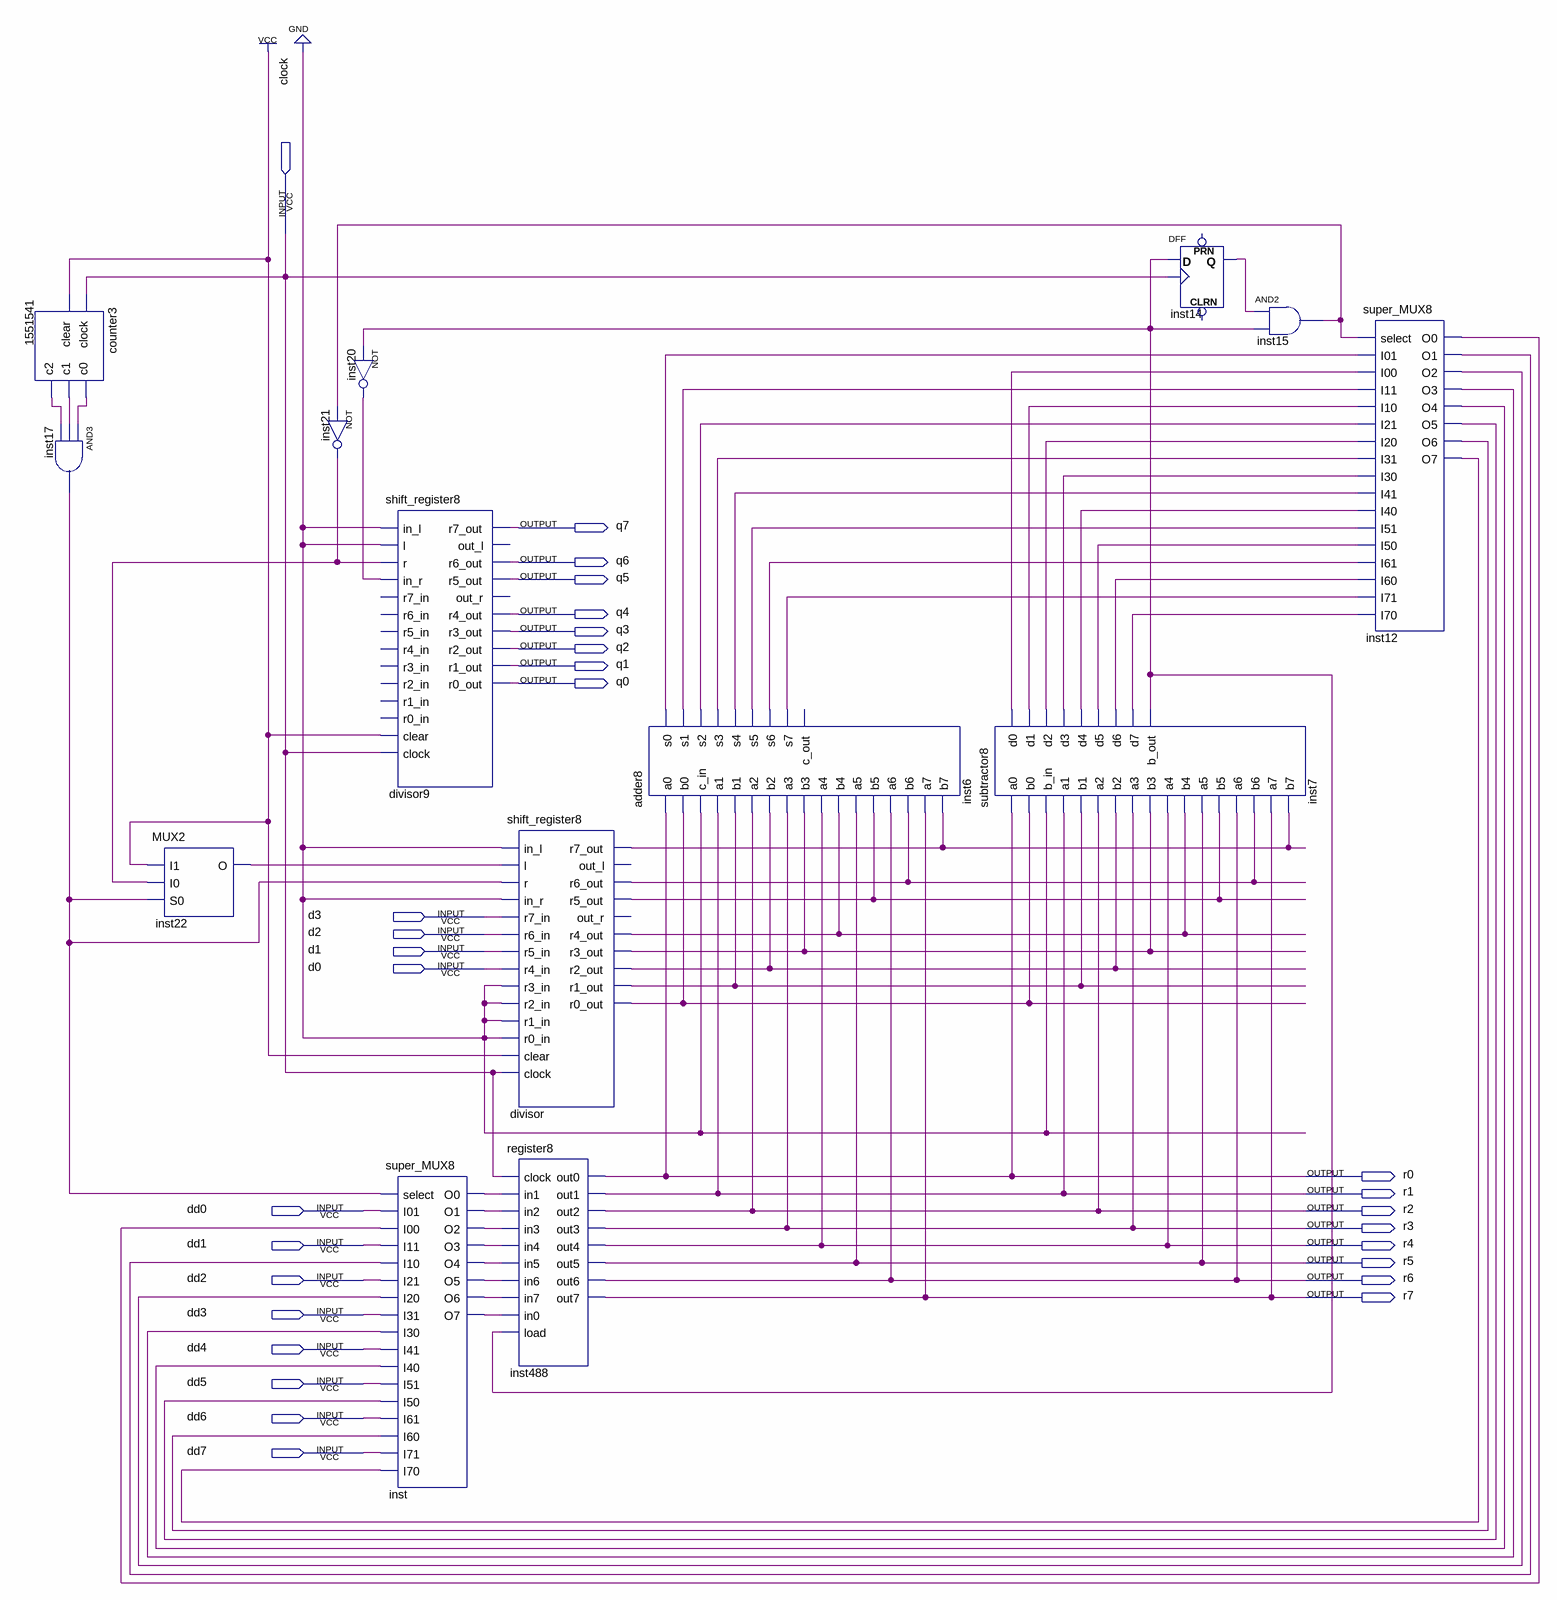
[diagram p0: schematic sheet]
// Quartus schematic Second.bdf as structural Verilog: 14 symbols, 29 pins
module Second (
  input  clock,
  input  d3,
  input  d2,
  input  d1,
  input  d0,
  input  dd0,
  input  dd1,
  input  dd2,
  input  dd3,
  input  dd4,
  input  dd5,
  input  dd6,
  input  dd7,
  output q7,
  output q6,
  output q5,
  output q4,
  output q3,
  output q2,
  output q1,
  output q0,
  output r0,
  output r1,
  output r2,
  output r3,
  output r4,
  output r5,
  output r6,
  output r7
);

  wire divisor_r0_out, divisor_r1_out, divisor_r2_out, divisor_r3_out, divisor_r4_out, divisor_r5_out,
       divisor_r6_out, divisor_r7_out, inst6_s0, inst6_s1, inst6_s2, inst6_s3, inst6_s4, inst6_s5, inst6_s6,
       inst6_s7, inst7_b_out, inst7_d0, inst7_d1, inst7_d2, inst7_d3, inst7_d4, inst7_d5, inst7_d6, inst7_d7,
       inst12_o0, inst12_o1, inst12_o2, inst12_o3, inst12_o4, inst12_o5, inst12_o6, inst12_o7, inst14_q,
       inst15_out, inst17_out, inst20_out, inst21_out, inst22_o, inst_o0, inst_o1, inst_o2, inst_o3, inst_o4,
       inst_o5, inst_o6, inst_o7, n1551541_c0, n1551541_c1, n1551541_c2;

  counter3 u_1551541 (.clock(clock), .clear(1'b1), .c0(n1551541_c0), .c1(n1551541_c1), .c2(n1551541_c2));
  and inst17 (inst17_out, n1551541_c0, n1551541_c1, n1551541_c2);
  MUX2 inst22 (.I1(1'b1), .I0(inst21_out), .S0(inst17_out), .O(inst22_o));
  not inst20 (inst20_out, inst7_b_out);
  not inst21 (inst21_out, inst15_out);
  shift_register8 divisor9 (
    .in_l(1'b0), .l(1'b0), .r(inst21_out), .in_r(inst20_out), .clear(1'b1), .clock(clock), .r7_out(q7),
    .r6_out(q6), .r5_out(q5), .r4_out(q4), .r3_out(q3), .r2_out(q2), .r1_out(q1), .r0_out(q0));  // open: r7_in, r6_in, r5_in, r4_in, r3_in, r2_in, r1_in, r0_in, out_l, out_r
  super_MUX8 inst (
    .select(inst17_out), .I01(dd0), .I00(inst12_o0), .I11(dd1), .I10(inst12_o1), .I21(dd2), .I20(inst12_o2),
    .I31(dd3), .I30(inst12_o3), .I41(dd4), .I40(inst12_o4), .I51(dd5), .I50(inst12_o5), .I61(dd6),
    .I60(inst12_o6), .I71(dd7), .I70(inst12_o7), .O0(inst_o0), .O1(inst_o1), .O2(inst_o2), .O3(inst_o3),
    .O4(inst_o4), .O5(inst_o5), .O6(inst_o6), .O7(inst_o7));
  shift_register8 divisor (
    .in_l(1'b0), .l(inst22_o), .r(inst17_out), .in_r(1'b0), .r7_in(d3), .r6_in(d2), .r5_in(d1), .r4_in(d0),
    .r3_in(1'b0), .r2_in(1'b0), .r1_in(1'b0), .r0_in(1'b0), .clear(1'b1), .clock(clock),
    .r7_out(divisor_r7_out), .r6_out(divisor_r6_out), .r5_out(divisor_r5_out), .r4_out(divisor_r4_out),
    .r3_out(divisor_r3_out), .r2_out(divisor_r2_out), .r1_out(divisor_r1_out), .r0_out(divisor_r0_out));  // open: out_l, out_r
  register8 inst488 (
    .clock(clock), .in1(inst_o0), .in2(inst_o1), .in3(inst_o2), .in4(inst_o3), .in5(inst_o4), .in6(inst_o5),
    .in7(inst_o6), .in0(inst_o7), .load(inst7_b_out), .out0(r0), .out1(r1), .out2(r2), .out3(r3), .out4(r4),
    .out5(r5), .out6(r6), .out7(r7));
  adder8 inst6 (
    .a0(r0), .b0(divisor_r0_out), .c_in(1'b0), .a1(r1), .b1(divisor_r1_out), .a2(r2), .b2(divisor_r2_out),
    .a3(r3), .b3(divisor_r3_out), .a4(r4), .b4(divisor_r4_out), .a5(r5), .b5(divisor_r5_out), .a6(r6),
    .b6(divisor_r6_out), .a7(r7), .b7(divisor_r7_out), .s0(inst6_s0), .s1(inst6_s1), .s2(inst6_s2),
    .s3(inst6_s3), .s4(inst6_s4), .s5(inst6_s5), .s6(inst6_s6), .s7(inst6_s7));  // open: c_out
  subtractor8 inst7 (
    .a0(r0), .b0(divisor_r0_out), .b_in(1'b0), .a1(r1), .b1(divisor_r1_out), .a2(r2), .b2(divisor_r2_out),
    .a3(r3), .b3(divisor_r3_out), .a4(r4), .b4(divisor_r4_out), .a5(r5), .b5(divisor_r5_out), .a6(r6),
    .b6(divisor_r6_out), .a7(r7), .b7(divisor_r7_out), .d0(inst7_d0), .d1(inst7_d1), .d2(inst7_d2),
    .d3(inst7_d3), .d4(inst7_d4), .d5(inst7_d5), .d6(inst7_d6), .d7(inst7_d7), .b_out(inst7_b_out));
  DFF inst14 (.CLK(clock), .D(inst7_b_out), .Q(inst14_q));  // open: CLRN, PRN
  and inst15 (inst15_out, inst14_q, inst7_b_out);
  super_MUX8 inst12 (
    .select(inst15_out), .I01(inst6_s0), .I00(inst7_d0), .I11(inst6_s1), .I10(inst7_d1), .I21(inst6_s2),
    .I20(inst7_d2), .I31(inst6_s3), .I30(inst7_d3), .I41(inst6_s4), .I40(inst7_d4), .I51(inst6_s5),
    .I50(inst7_d5), .I61(inst6_s6), .I60(inst7_d6), .I71(inst6_s7), .I70(inst7_d7), .O0(inst12_o0),
    .O1(inst12_o1), .O2(inst12_o2), .O3(inst12_o3), .O4(inst12_o4), .O5(inst12_o5), .O6(inst12_o6),
    .O7(inst12_o7));
endmodule
